# Altium project pulseox_brakeout_LCD_PCB.PrjPcb
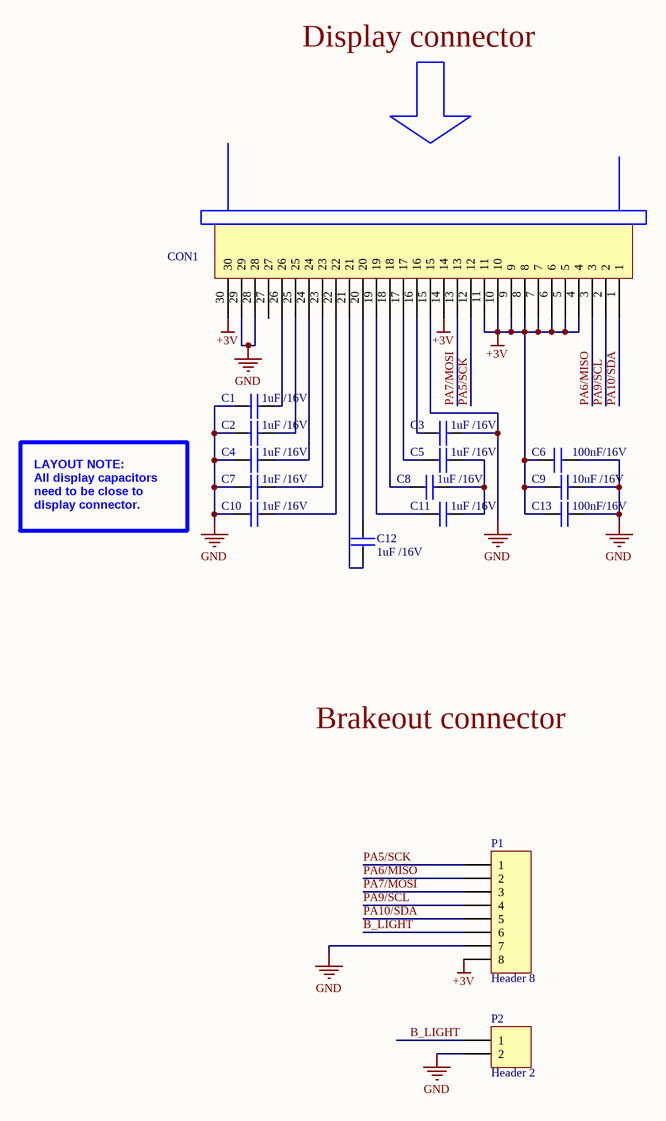
[diagram p0: pulseox_brakeout_LCD_SCH.SchDoc]
1 sheet, 16 parts. Net scope: global (net labels, ports and power ports of the same name join across sheets).
Board file: pulseox_brakeout_LCD_PCB.PcbDoc

## Sheet pulseox_brakeout_LCD_SCH.SchDoc
size A3

### Parts
C1  1uF /16V  [CAP0805]
C2  1uF /16V  [CAP0805]
C3  1uF /16V  [CAP0805]
C4  1uF /16V  [CAP0805]
C5  1uF /16V  [CAP0805]
C6  100nF/16V  [CAP0805]
C7  1uF /16V  [CAP0805]
C8  1uF /16V  [CAP0805]
C9  10uF /16V  [CAP0805]
C10  1uF /16V  [CAP0805]
C11  1uF /16V  [CAP0805]
C12  1uF /16V  [CAP0805]
C13  100nF/16V  [CAP0805]
CON1  3-1734592-0  [FPC P0.5mm SMT]  (value not drawn)
P1  Header 8  [HDR1X8]
P2  Header 2  [HDR1X2]

### Nets
+3V: C6.1 C9.1 C13.1 CON1.4 CON1.5 CON1.6 CON1.7 CON1.8 CON1.9 CON1.10 CON1.11 CON1.14 CON1.30 P1.8
GND: C1.1 C2.1 C3.2 C4.1 C6.2 C7.1 C9.2 C10.1 C13.2 CON1.15 CON1.28 CON1.29 P1.7 P2.2
B_LIGHT: P1.6 P2.1
PA5/SCK: CON1.12 P1.1
PA6/MISO: CON1.3 P1.2
PA7/MOSI: CON1.13 P1.3
PA9/SCL: CON1.2 P1.4
PA10/SDA: CON1.1 P1.5
NetC1_2: C1.2 CON1.26
NetC2_2: C2.2 CON1.25
NetC3_1: C3.1 CON1.16
NetC4_2: C4.2 CON1.24
NetC5_1: C5.1 CON1.17
NetC5_2: C5.2 C8.2 C11.2
NetC7_2: C7.2 CON1.23
NetC8_1: C8.1 CON1.18
NetC10_2: C10.2 CON1.22
NetC11_1: C11.1 CON1.19
NetC12_1: C12.1 CON1.21
NetC12_2: C12.2 CON1.20

Not connected (* = marked no-connect by the designer): CON1 27

### Notes on the sheet
- Display connector
- LAYOUT NOTE:
  All display capacitors
  need to be close to
  display connector.
- Brakeout connector

### Library data of the parts
C1-C5 C7 C8 C10-C12 = 1uF /16V: MURATA - GRM21BR71C105KA01L - CAP, MLCC, X7R, 1UF, 16V, 0805; Supplier 1: Farnell; Manufacturer: MURATA; Manufacturer Part Number: GRM21BR71C105KA01L; RoHS: YES; Stock 1: 58053; Pricing 1: 5=0.0398, 50=0.0331, 250=0.0235, 500=0.022, 1500=0.018 (GBP); ComponentLink1URL: http://www.farnell.com/datasheets/2047889.pdf; ComponentLink1Description: http://www.farnell.com/datasheets/2047889.pdf; ComponentLink2URL: http://www.farnell.com/cad/1547313.zip; ComponentLink2Description: http://www.farnell.com/cad/1547313.zip; ComponentLink3URL: http://www.farnell.com/datasheets/2006461.pdf; ComponentLink3Description: http://www.farnell.com/datasheets/2006461.pdf; Supplier Part Number 1: 9527710
C6 C13 = 100nF 16V 0805: MURATA - GRM219R71C104KA01D - CAP, MLCC, X7R, 0.1UF, 16V, 0805; Ceramic Capacitor Case: 0805 [2012 Metric]; Capacitance: 0.1; Voltage Rating: 16; Capacitance Tolerance: ± 10%; Dielectric Characteristic: X7; Product Range: GRM Series; SVHC: No SVHC (17-Dec-2015; Supplier 1: Farnell; Manufacturer: MURATA; Manufacturer Part Number: GRM219R71C104KA01D; RoHS: YES; Stock 1: 4286; Pricing 1: 10=0.0517, 100=0.0335, 500=0.0221, 1000=0.02, 2000=0.0175, 4000=0.0134, 20000=0.0095, 40000=0.0081 (GBP); Packaging: Cut Tape; Operating Temperature Min: -55; Operating Temperature Max: 125; Automotive Qualification Standard: -; MSL: MSL 1 - Unlimited; ComponentLink1URL: http://www.farnell.com/datasheets/2079178.pdf; ComponentLink1Description: http://www.farnell.com/datasheets/2079178.pdf; ComponentLink2URL: http://www.farnell.com/datasheets/1935878.pdf; ComponentLink2Description: http://www.farnell.com/datasheets/1935878.pdf; Supplier Part Number 1: 2611934
C9 = 10uF /16V: TDK - CGA4J1X5R1C106K125AC - CAP, MLCC, X5R, 10UF, 16V, 0805; Supplier 1: Farnell; Manufacturer: TDK; Manufacturer Part Number: CGA4J1X5R1C106K125AC; RoHS: YES; Stock 1: 8974; Pricing 1: 5=0.41, 50=0.146, 250=0.131, 500=0.12, 1000=0.103 (GBP); ComponentLink1URL: http://bcove.me/e1v54mtm; ComponentLink1Description: http://bcove.me/e1v54mtm; ComponentLink2URL: http://www.farnell.com/datasheets/1936565.pdf; ComponentLink2Description: http://www.farnell.com/datasheets/1936565.pdf; ComponentLink3URL: http://www.farnell.com/datasheets/1683658.pdf; ComponentLink3Description: http://www.farnell.com/datasheets/1683658.pdf; Supplier Part Number 1: 2210948RL
CON1 = 3-1734592-0: AMP - TE CONNECTIVITY - 3-1734592-0 - CONNECTOR, FFC / FPC, 0.5MM, 30WAY; Supplier 1: Farnell; Manufacturer: AMP - TE CONNECTIVITY; Manufacturer Part Number: 3-1734592-0; RoHS: YES; Pricing 1: 1=0.616, 25=0.557, 100=0.485, 250=0.442, 500=0.399 (GBP); ComponentLink1URL: http://www.tycoelectronics.com/commerce/DocumentDelivery/DDEController?Action=srchrtrv&DocNm=CVM_3-1734592-0&DocType=Customer+View+Model&DocLang=3D; ComponentLink1Description: http://www.tycoelectronics.com/commerce/DocumentDelivery/DDEController?Action=srchrtrv&DocNm=CVM_3-1734592-0&DocType=Customer+View+Model&DocLang=3D; ComponentLink2URL: http://www.farnell.com/cad/1650059.pdf; ComponentLink2Description: http://www.farnell.com/cad/1650059.pdf; ComponentLink3URL: http://www.farnell.com/datasheets/586796.pdf; ComponentLink3Description: http://www.farnell.com/datasheets/586796.pdf; Supplier Part Number 1: 1816393
P1 = Header 8: Header, 8-Pin; LatestRevisionDate: 17-Jul-2002; LatestRevisionNote: Re-released for DXP Platform.; Publisher: Altium Limited
P2 = Header 2: Header, 2-Pin; LatestRevisionDate: 17-Jul-2002; LatestRevisionNote: Re-released for DXP Platform.; Publisher: Altium Limited